# EAGLE schematic fpga-cplds-v2 (EAGLE 5.06)
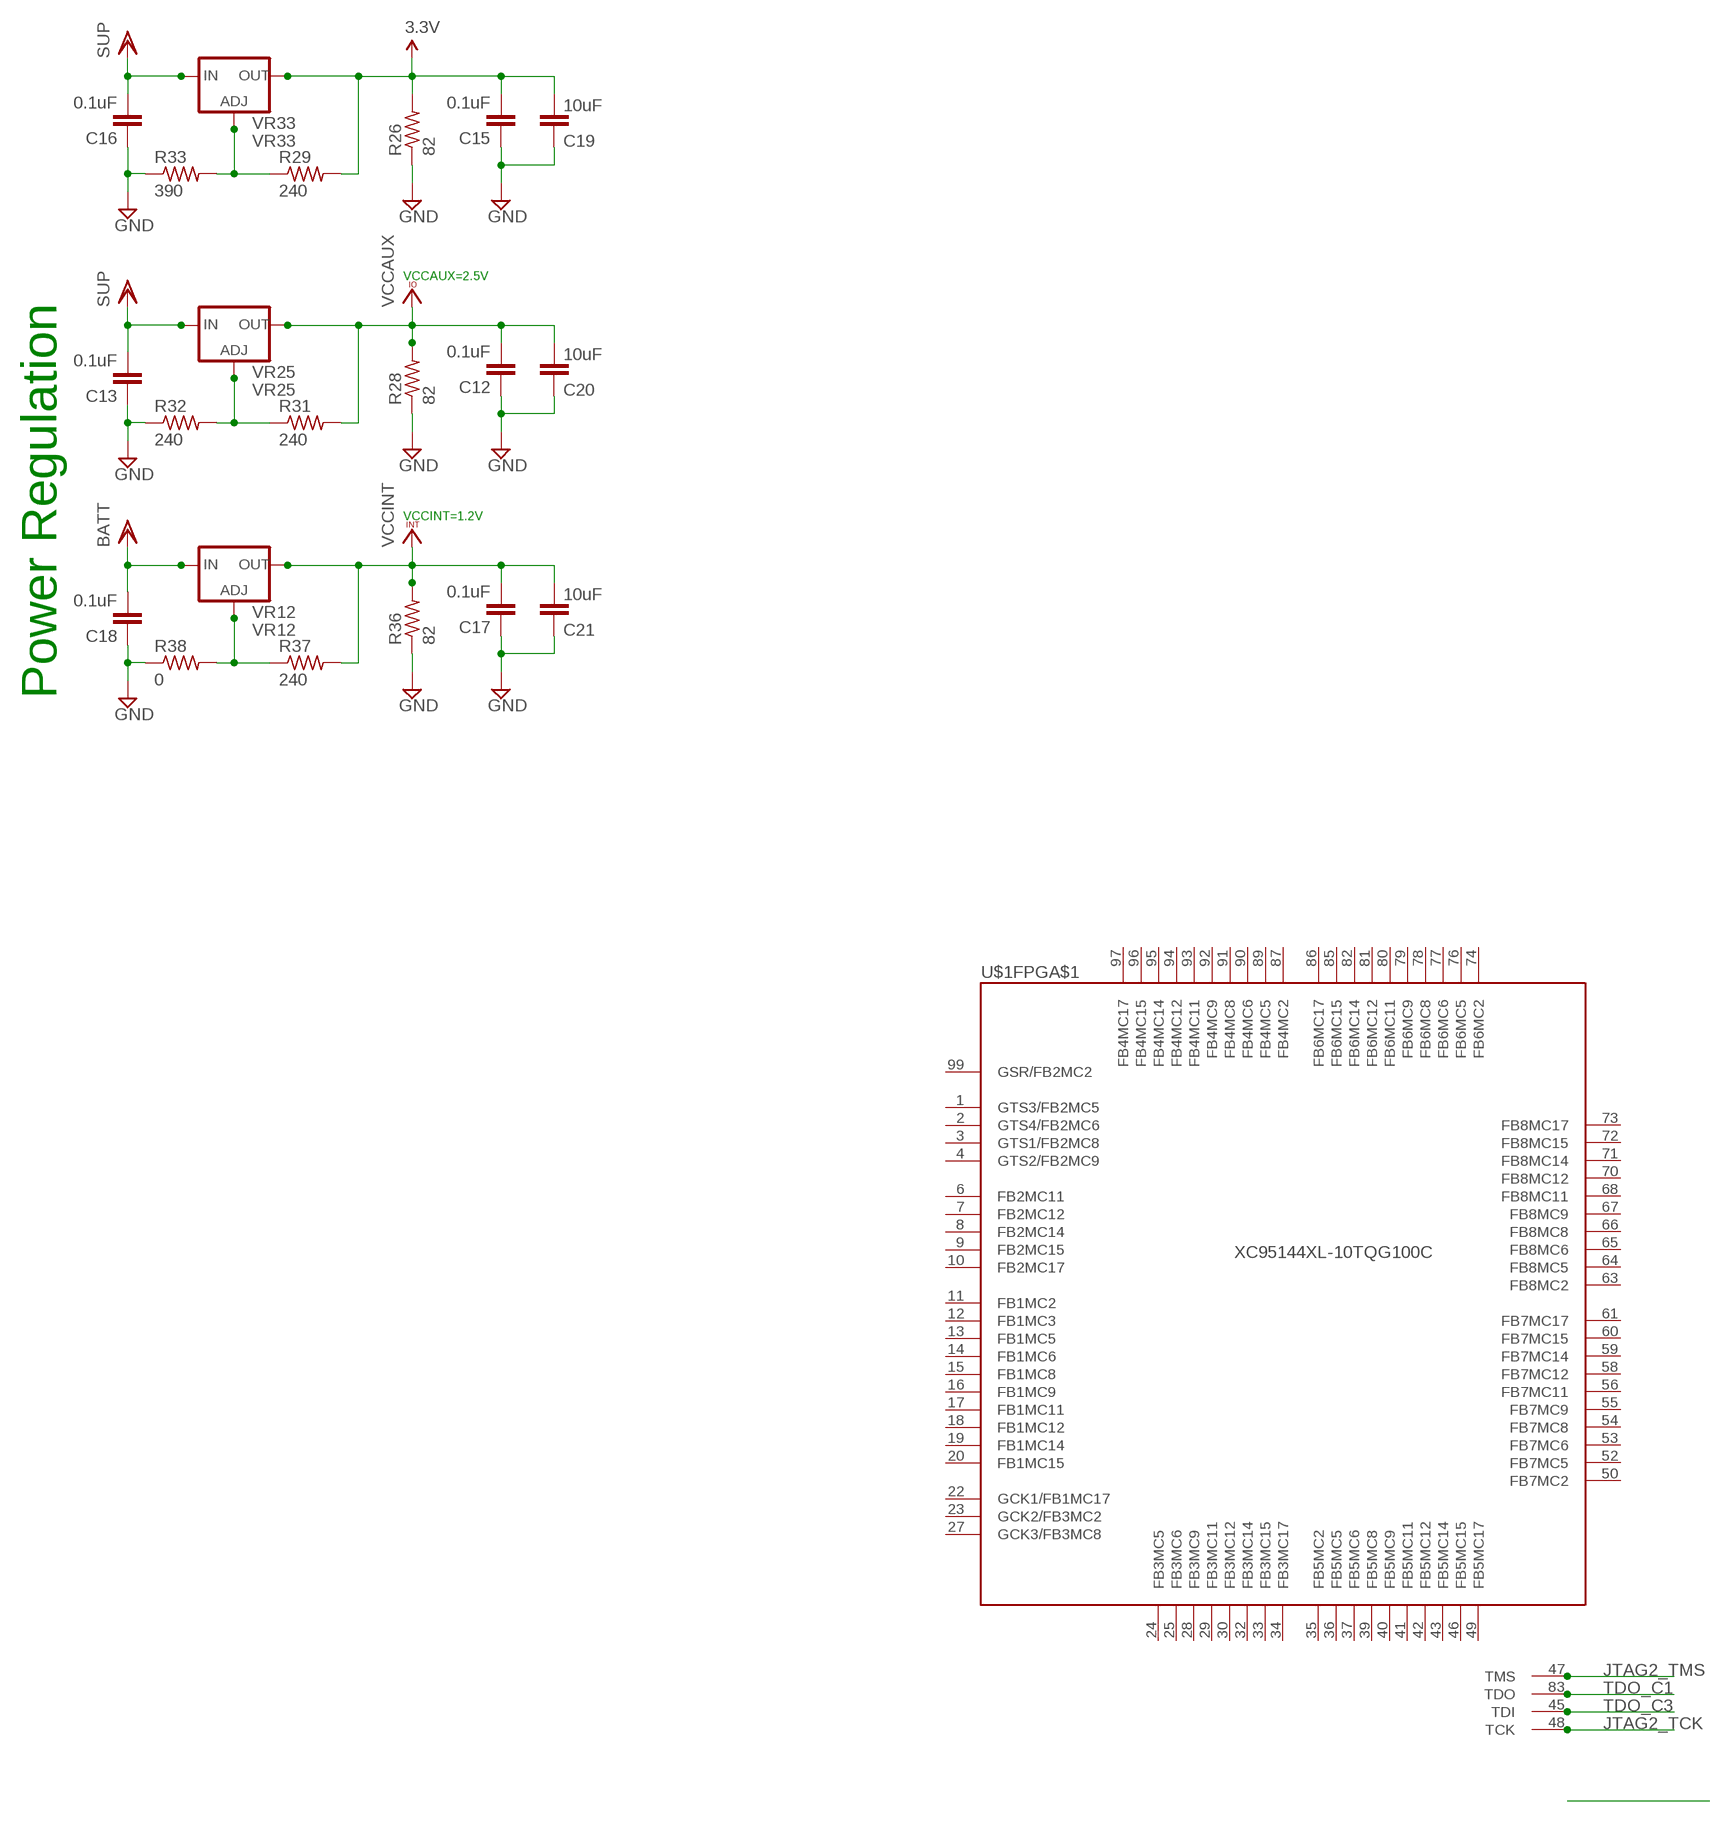
[diagram p0: schematic, sheet 1, part 1 of 2]
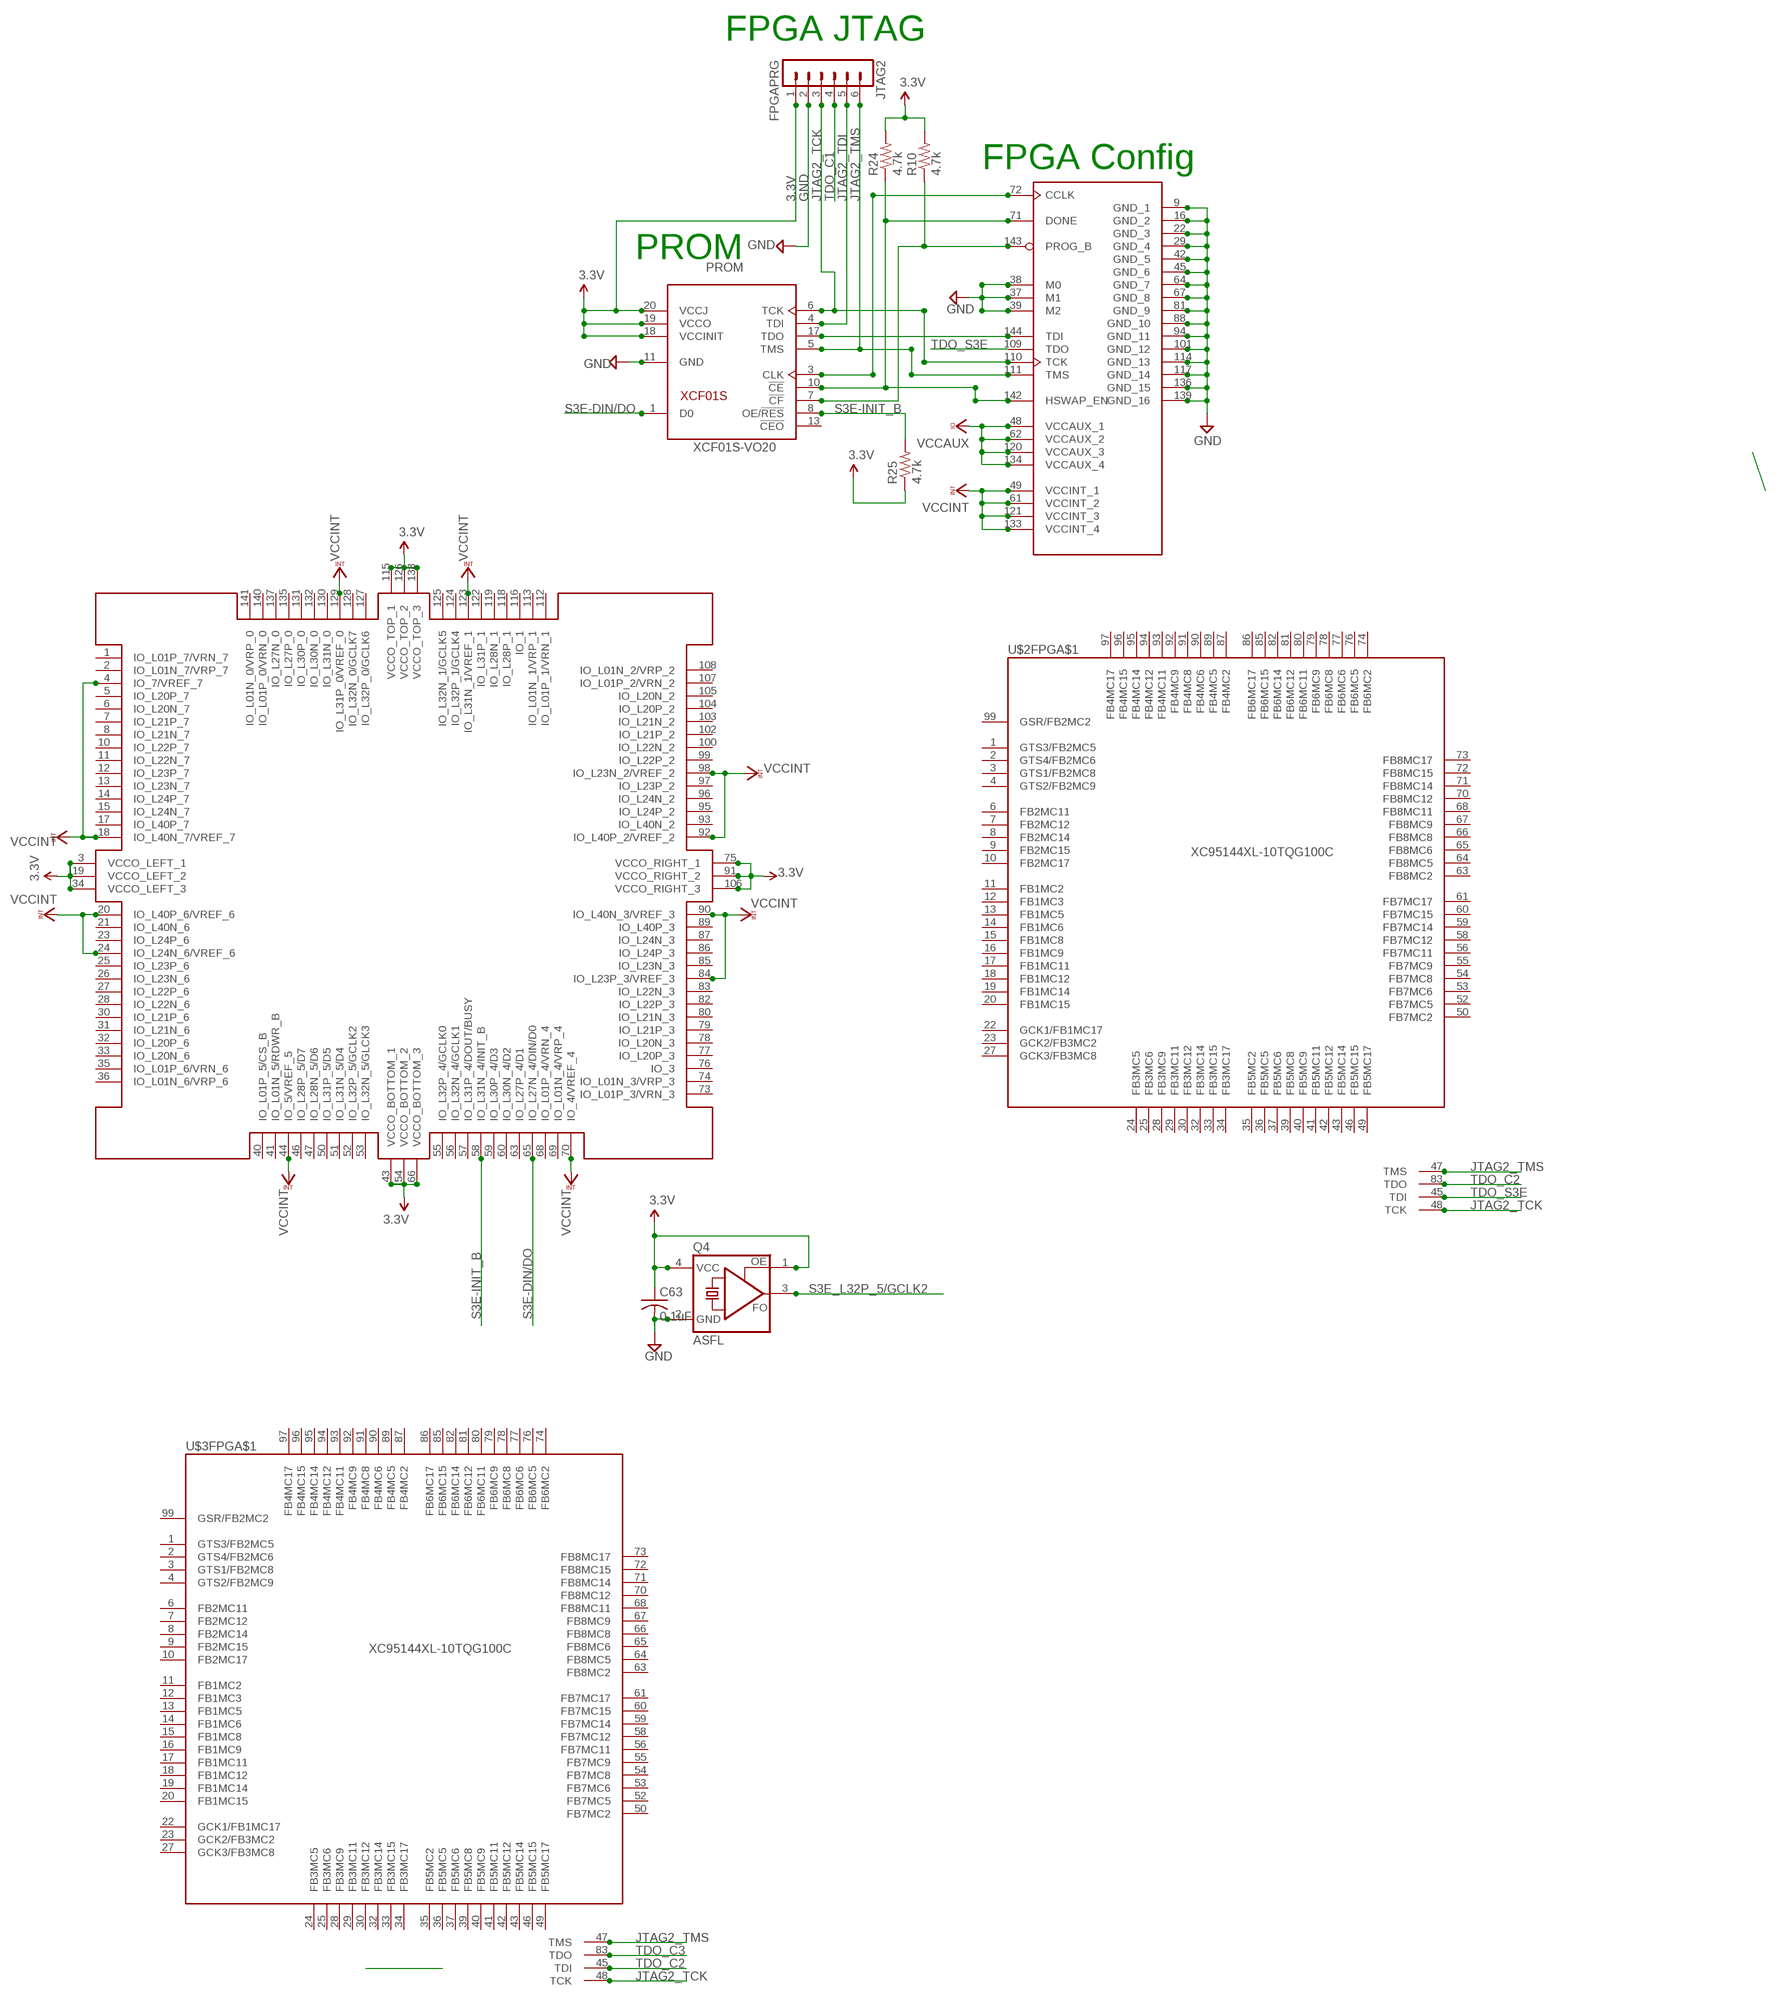
[diagram p1: schematic, sheet 1, part 2 of 2]

## Parts
C12  0.1uF  C-EUC0402  [C0402]
C13  0.1uF  C-EUC0402  [C0402]
C15  0.1uF  C-EUC0402  [C0402]
C16  0.1uF  C-EUC0402  [C0402]
C17  0.1uF  C-EUC0402  [C0402]
C18  0.1uF  C-EUC0402  [C0402]
C19  10uF  C-EUC1206  [C1206]
C20  10uF  C-EUC1206  [C1206]
C21  10uF  C-EUC1206  [C1206]
C63  0.1uF  C-USC0402  [C0402]
FPGA  XC3S200-TQ144  [TQ144]
JTAG2  FPGAPRG  MA06-1  [MA06-1]
PROM  XCF01S-VO20  [VO20]
Q4  ASFL  [ASF]
R10  4.7k  R-US_R0402  [R0402]
R24  4.7k  R-US_R0402  [R0402]
R25  4.7k  R-US_R0402  [R0402]
R26  82  R-US_R0402  [R0402]
R28  82  R-US_R0402  [R0402]
R29  240  R-US_R0402  [R0402]
R31  240  R-US_R0402  [R0402]
R32  240  R-US_R0402  [R0402]
R33  390  R-US_R0402  [R0402]
R36  82  R-US_R0402  [R0402]
R37  240  R-US_R0402  [R0402]
R38  0  R-US_R0402  [R0402]
U$1  XC95144XL-10TQG100C  [TQFP100]
U$2  XC95144XL-10TQG100C  [TQFP100]
U$3  XC95144XL-10TQG100C  [TQFP100]
VR12  VR12  V_REG_317SMD  [SOT223]
VR25  VR25  V_REG_317SMD  [SOT223]
VR33  VR33  V_REG_317SMD  [SOT223]

## Nets
3.3V: C15.2 C19.2 C63.1 FPGA.3(VCCO_LEFT_1) FPGA.19(VCCO_LEFT_2) FPGA.34(VCCO_LEFT_3) FPGA.43(VCCO_BOTTOM_1) FPGA.54(VCCO_BOTTOM_2) FPGA.66(VCCO_BOTTOM_3) FPGA.75(VCCO_RIGHT_1) FPGA.91(VCCO_RIGHT_2) FPGA.106(VCCO_RIGHT_3) FPGA.115(VCCO_TOP_1) FPGA.126(VCCO_TOP_2) FPGA.138(VCCO_TOP_3) JTAG2.1 PROM.18(VCCINIT) PROM.19(VCCO) PROM.20(VCCJ) Q4.1(OE) Q4.4(VCC) R10.2 R24.2 R25.1 R26.2 R29.2 VR33.2(OUT)
FPGA: FPGA.71(DONE) FPGA.142(HSWAP_EN) PROM.10(!CE) R24.1
GND: C12.1 C13.1 C15.1 C16.1 C17.1 C18.1 C19.1 C20.1 C21.1 C63.2 FPGA.9(GND_1) FPGA.16(GND_2) FPGA.22(GND_3) FPGA.29(GND_4) FPGA.37(M1) FPGA.38(M0) FPGA.39(M2) FPGA.42(GND_5) FPGA.45(GND_6) FPGA.64(GND_7) FPGA.67(GND_8) FPGA.81(GND_9) FPGA.88(GND_10) FPGA.94(GND_11) FPGA.101(GND_12) FPGA.114(GND_13) FPGA.117(GND_14) FPGA.136(GND_15) FPGA.139(GND_16) JTAG2.2 PROM.11(GND) Q4.2(GND) R26.1 R28.1 R32.1 R33.1 R36.1 R38.1
JTAG2_TCK: FPGA.110(TCK) JTAG2.3 PROM.6(TCK) U$1.48(TCK) U$2.48(TCK) U$3.48(TCK)
JTAG2_TDI: JTAG2.5 PROM.4(TDI)
JTAG2_TMS: FPGA.111(TMS) JTAG2.6 PROM.5(TMS) U$1.47(TMS) U$2.47(TMS) U$3.47(TMS)
N$12: FPGA.143(PROG_B) PROM.7(!CF) R10.1
N$22: R31.1 R32.2 VR25.1(ADJ)
N$25: R29.1 R33.2 VR33.1(ADJ)
N$28: R37.1 R38.2 VR12.1(ADJ)
N$40: FPGA.72(CCLK) PROM.3(CLK)
N$44: FPGA.144(TDI) PROM.17(TDO)
S3E-DIN/DO: FPGA.65(IO_L27N_4/DIN/D0) PROM.1(D0)
S3E-INIT_B: FPGA.58(IO_L31N_4/INIT_B) PROM.8(OE/!RES) R25.2
S3E_L32P_5/GCLK2: Q4.3(FO)
TDO_C1: JTAG2.4 U$1.83(TDO)
TDO_C2: U$2.83(TDO) U$3.45(TDI)
TDO_C3: U$1.45(TDI) U$3.83(TDO)
TDO_S3E: FPGA.109(TDO) U$2.45(TDI)
VCCINT: C17.2 C21.2 FPGA.4(IO_7/VREF_7) FPGA.18(IO_L40N_7/VREF_7) FPGA.20(IO_L40P_6/VREF_6) FPGA.24(IO_L24N_6/VREF_6) FPGA.44(IO_5/VREF_5) FPGA.49(VCCINT_1) FPGA.61(VCCINT_2) FPGA.70(IO_4/VREF_4) FPGA.84(IO_L23P_3/VREF_3) FPGA.90(IO_L40N_3/VREF_3) FPGA.92(IO_L40P_2/VREF_2) FPGA.98(IO_L23N_2/VREF_2) FPGA.121(VCCINT_3) FPGA.123(IO_L31N_1/VREF_1) FPGA.129(IO_L31P_0/VREF_0) FPGA.133(VCCINT_4) R36.2 R37.2 VR12.2(OUT)
VCCIO: C12.2 C20.2 FPGA.48(VCCAUX_1) FPGA.62(VCCAUX_2) FPGA.120(VCCAUX_3) FPGA.134(VCCAUX_4) R28.2 R31.2 VR25.2(OUT) ; supply symbol labelled VCCAUX
VDD: C13.2 C16.2 C18.2 VR12.3(IN) VR25.3(IN) VR33.3(IN) ; supply symbol labelled BATT, SUP
Unconnected: FPGA.1(IO_L01P_7/VRN_7) FPGA.2(IO_L01N_7/VRP_7) FPGA.5(IO_L20P_7) FPGA.6(IO_L20N_7) FPGA.7(IO_L21P_7) FPGA.8(IO_L21N_7) FPGA.10(IO_L22P_7) FPGA.11(IO_L22N_7) FPGA.12(IO_L23P_7) FPGA.13(IO_L23N_7) FPGA.14(IO_L24P_7) FPGA.15(IO_L24N_7) FPGA.17(IO_L40P_7) FPGA.21(IO_L40N_6) FPGA.23(IO_L24P_6) FPGA.25(IO_L23P_6) FPGA.26(IO_L23N_6) FPGA.27(IO_L22P_6) FPGA.28(IO_L22N_6) FPGA.30(IO_L21P_6) FPGA.31(IO_L21N_6) FPGA.32(IO_L20P_6) FPGA.33(IO_L20N_6) FPGA.35(IO_L01P_6/VRN_6) FPGA.36(IO_L01N_6/VRP_6) FPGA.40(IO_L01P_5/CS_B) FPGA.41(IO_L01N_5/RDWR_B) FPGA.46(IO_L28P_5/D7) FPGA.47(IO_L28N_5/D6) FPGA.50(IO_L31P_5/D5) FPGA.51(IO_L31N_5/D4) FPGA.52(IO_L32P_5/GCLK2) FPGA.53(IO_L32N_5/GLCK3) FPGA.55(IO_L32P_4/GCLK0) FPGA.56(IO_L32N_4/GCLK1) FPGA.57(IO_L31P_4/DOUT/BUSY) FPGA.59(IO_L30P_4/D3) FPGA.60(IO_L30N_4/D2) FPGA.63(IO_L27P_4/D1) FPGA.68(IO_L01P_4/VRN_4) FPGA.69(IO_L01N_4/VRP_4) FPGA.73(IO_L01P_3/VRN_3) FPGA.74(IO_L01N_3/VRP_3) FPGA.76(IO_3) FPGA.77(IO_L20P_3) FPGA.78(IO_L20N_3) FPGA.79(IO_L21P_3) FPGA.80(IO_L21N_3) FPGA.82(IO_L22P_3) FPGA.83(IO_L22N_3) FPGA.85(IO_L23N_3) FPGA.86(IO_L24P_3) FPGA.87(IO_L24N_3) FPGA.89(IO_L40P_3) FPGA.93(IO_L40N_2) FPGA.95(IO_L24P_2) FPGA.96(IO_L24N_2) FPGA.97(IO_L23P_2) FPGA.99(IO_L22P_2) FPGA.100(IO_L22N_2) FPGA.102(IO_L21P_2) FPGA.103(IO_L21N_2) FPGA.104(IO_L20P_2) FPGA.105(IO_L20N_2) FPGA.107(IO_L01P_2/VRN_2) FPGA.108(IO_L01N_2/VRP_2) FPGA.112(IO_L01P_1/VRN_1) FPGA.113(IO_L01N_1/VRP_1) FPGA.116(IO_1) FPGA.118(IO_L28P_1) FPGA.119(IO_L28N_1) FPGA.122(IO_L31P_1) FPGA.124(IO_L32P_1/GCLK4) FPGA.125(IO_L32N_1/GCLK5) FPGA.127(IO_L32P_0/GCLK6) FPGA.128(IO_L32N_0/GCLK7) FPGA.130(IO_L31N_0) FPGA.131(IO_L30P_0) FPGA.132(IO_L30N_0) FPGA.135(IO_L27P_0) FPGA.137(IO_L27N_0) FPGA.140(IO_L01P_0/VRN_0) FPGA.141(IO_L01N_0/VRP_0) PROM.13(!CEO) U$1.1(FPGA$1:GTS3/FB2MC5) U$1.2(FPGA$1:GTS4/FB2MC6) U$1.3(FPGA$1:GTS1/FB2MC8) U$1.4(FPGA$1:GTS2/FB2MC9) U$1.5(VCCINT1) U$1.6(FPGA$1:FB2MC11) U$1.7(FPGA$1:FB2MC12) U$1.8(FPGA$1:FB2MC14) U$1.9(FPGA$1:FB2MC15) U$1.10(FPGA$1:FB2MC17) U$1.11(FPGA$1:FB1MC2) U$1.12(FPGA$1:FB1MC3) U$1.13(FPGA$1:FB1MC5) U$1.14(FPGA$1:FB1MC6) U$1.15(FPGA$1:FB1MC8) U$1.16(FPGA$1:FB1MC9) U$1.17(FPGA$1:FB1MC11) U$1.18(FPGA$1:FB1MC12) U$1.19(FPGA$1:FB1MC14) U$1.20(FPGA$1:FB1MC15) U$1.21(GND1) U$1.22(FPGA$1:GCK1/FB1MC17) U$1.23(FPGA$1:GCK2/FB3MC2) U$1.24(FPGA$1:FB3MC5) U$1.25(FPGA$1:FB3MC6) U$1.26(VCCIO1) U$1.27(FPGA$1:GCK3/FB3MC8) U$1.28(FPGA$1:FB3MC9) U$1.29(FPGA$1:FB3MC11) U$1.30(FPGA$1:FB3MC12) U$1.31(GND2) U$1.32(FPGA$1:FB3MC14) U$1.33(FPGA$1:FB3MC15) U$1.34(FPGA$1:FB3MC17) U$1.35(FPGA$1:FB5MC2) U$1.36(FPGA$1:FB5MC5) U$1.37(FPGA$1:FB5MC6) U$1.38(VCCIO2) U$1.39(FPGA$1:FB5MC8) U$1.40(FPGA$1:FB5MC9) U$1.41(FPGA$1:FB5MC11) U$1.42(FPGA$1:FB5MC12) U$1.43(FPGA$1:FB5MC14) U$1.44(GND3) U$1.46(FPGA$1:FB5MC15) U$1.49(FPGA$1:FB5MC17) U$1.50(FPGA$1:FB7MC2) U$1.51(VCCIO3) U$1.52(FPGA$1:FB7MC5) U$1.53(FPGA$1:FB7MC6) U$1.54(FPGA$1:FB7MC8) U$1.55(FPGA$1:FB7MC9) U$1.56(FPGA$1:FB7MC11) U$1.57(VCCINT2) U$1.58(FPGA$1:FB7MC12) U$1.59(FPGA$1:FB7MC14) U$1.60(FPGA$1:FB7MC15) U$1.61(FPGA$1:FB7MC17) U$1.62(GND4) U$1.63(FPGA$1:FB8MC2) U$1.64(FPGA$1:FB8MC5) U$1.65(FPGA$1:FB8MC6) U$1.66(FPGA$1:FB8MC8) U$1.67(FPGA$1:FB8MC9) U$1.68(FPGA$1:FB8MC11) U$1.69(GND5) U$1.70(FPGA$1:FB8MC12) U$1.71(FPGA$1:FB8MC14) U$1.72(FPGA$1:FB8MC15) U$1.73(FPGA$1:FB8MC17) U$1.74(FPGA$1:FB6MC2) U$1.75(GND6) U$1.76(FPGA$1:FB6MC5) U$1.77(FPGA$1:FB6MC6) U$1.78(FPGA$1:FB6MC8) U$1.79(FPGA$1:FB6MC9) U$1.80(FPGA$1:FB6MC11) U$1.81(FPGA$1:FB6MC12) U$1.82(FPGA$1:FB6MC14) U$1.84(GND7) U$1.85(FPGA$1:FB6MC15) U$1.86(FPGA$1:FB6MC17) U$1.87(FPGA$1:FB4MC2) U$1.88(VCCIO4) U$1.89(FPGA$1:FB4MC5) U$1.90(FPGA$1:FB4MC6) U$1.91(FPGA$1:FB4MC8) U$1.92(FPGA$1:FB4MC9) U$1.93(FPGA$1:FB4MC11) U$1.94(FPGA$1:FB4MC12) U$1.95(FPGA$1:FB4MC14) U$1.96(FPGA$1:FB4MC15) U$1.97(FPGA$1:FB4MC17) U$1.98(VCCINT3) U$1.99(FPGA$1:GSR/FB2MC2) U$1.100(GND8) U$2.1(FPGA$1:GTS3/FB2MC5) U$2.2(FPGA$1:GTS4/FB2MC6) U$2.3(FPGA$1:GTS1/FB2MC8) U$2.4(FPGA$1:GTS2/FB2MC9) U$2.5(VCCINT1) U$2.6(FPGA$1:FB2MC11) U$2.7(FPGA$1:FB2MC12) U$2.8(FPGA$1:FB2MC14) U$2.9(FPGA$1:FB2MC15) U$2.10(FPGA$1:FB2MC17) U$2.11(FPGA$1:FB1MC2) U$2.12(FPGA$1:FB1MC3) U$2.13(FPGA$1:FB1MC5) U$2.14(FPGA$1:FB1MC6) U$2.15(FPGA$1:FB1MC8) U$2.16(FPGA$1:FB1MC9) U$2.17(FPGA$1:FB1MC11) U$2.18(FPGA$1:FB1MC12) U$2.19(FPGA$1:FB1MC14) U$2.20(FPGA$1:FB1MC15) U$2.21(GND1) U$2.22(FPGA$1:GCK1/FB1MC17) U$2.23(FPGA$1:GCK2/FB3MC2) U$2.24(FPGA$1:FB3MC5) U$2.25(FPGA$1:FB3MC6) U$2.26(VCCIO1) U$2.27(FPGA$1:GCK3/FB3MC8) U$2.28(FPGA$1:FB3MC9) U$2.29(FPGA$1:FB3MC11) U$2.30(FPGA$1:FB3MC12) U$2.31(GND2) U$2.32(FPGA$1:FB3MC14) U$2.33(FPGA$1:FB3MC15) U$2.34(FPGA$1:FB3MC17) U$2.35(FPGA$1:FB5MC2) U$2.36(FPGA$1:FB5MC5) U$2.37(FPGA$1:FB5MC6) U$2.38(VCCIO2) U$2.39(FPGA$1:FB5MC8) U$2.40(FPGA$1:FB5MC9) U$2.41(FPGA$1:FB5MC11) U$2.42(FPGA$1:FB5MC12) U$2.43(FPGA$1:FB5MC14) U$2.44(GND3) U$2.46(FPGA$1:FB5MC15) U$2.49(FPGA$1:FB5MC17) U$2.50(FPGA$1:FB7MC2) U$2.51(VCCIO3) U$2.52(FPGA$1:FB7MC5) U$2.53(FPGA$1:FB7MC6) U$2.54(FPGA$1:FB7MC8) U$2.55(FPGA$1:FB7MC9) U$2.56(FPGA$1:FB7MC11) U$2.57(VCCINT2) U$2.58(FPGA$1:FB7MC12) U$2.59(FPGA$1:FB7MC14) U$2.60(FPGA$1:FB7MC15) U$2.61(FPGA$1:FB7MC17) U$2.62(GND4) U$2.63(FPGA$1:FB8MC2) U$2.64(FPGA$1:FB8MC5) U$2.65(FPGA$1:FB8MC6) U$2.66(FPGA$1:FB8MC8) U$2.67(FPGA$1:FB8MC9) U$2.68(FPGA$1:FB8MC11) U$2.69(GND5) U$2.70(FPGA$1:FB8MC12) U$2.71(FPGA$1:FB8MC14) U$2.72(FPGA$1:FB8MC15) U$2.73(FPGA$1:FB8MC17) U$2.74(FPGA$1:FB6MC2) U$2.75(GND6) U$2.76(FPGA$1:FB6MC5) U$2.77(FPGA$1:FB6MC6) U$2.78(FPGA$1:FB6MC8) U$2.79(FPGA$1:FB6MC9) U$2.80(FPGA$1:FB6MC11) U$2.81(FPGA$1:FB6MC12) U$2.82(FPGA$1:FB6MC14) U$2.84(GND7) U$2.85(FPGA$1:FB6MC15) U$2.86(FPGA$1:FB6MC17) U$2.87(FPGA$1:FB4MC2) U$2.88(VCCIO4) U$2.89(FPGA$1:FB4MC5) U$2.90(FPGA$1:FB4MC6) U$2.91(FPGA$1:FB4MC8) U$2.92(FPGA$1:FB4MC9) U$2.93(FPGA$1:FB4MC11) U$2.94(FPGA$1:FB4MC12) U$2.95(FPGA$1:FB4MC14) U$2.96(FPGA$1:FB4MC15) U$2.97(FPGA$1:FB4MC17) U$2.98(VCCINT3) U$2.99(FPGA$1:GSR/FB2MC2) U$2.100(GND8) U$3.1(FPGA$1:GTS3/FB2MC5) U$3.2(FPGA$1:GTS4/FB2MC6) U$3.3(FPGA$1:GTS1/FB2MC8) U$3.4(FPGA$1:GTS2/FB2MC9) U$3.5(VCCINT1) U$3.6(FPGA$1:FB2MC11) U$3.7(FPGA$1:FB2MC12) U$3.8(FPGA$1:FB2MC14) U$3.9(FPGA$1:FB2MC15) U$3.10(FPGA$1:FB2MC17) U$3.11(FPGA$1:FB1MC2) U$3.12(FPGA$1:FB1MC3) U$3.13(FPGA$1:FB1MC5) U$3.14(FPGA$1:FB1MC6) U$3.15(FPGA$1:FB1MC8) U$3.16(FPGA$1:FB1MC9) U$3.17(FPGA$1:FB1MC11) U$3.18(FPGA$1:FB1MC12) U$3.19(FPGA$1:FB1MC14) U$3.20(FPGA$1:FB1MC15) U$3.21(GND1) U$3.22(FPGA$1:GCK1/FB1MC17) U$3.23(FPGA$1:GCK2/FB3MC2) U$3.24(FPGA$1:FB3MC5) U$3.25(FPGA$1:FB3MC6) U$3.26(VCCIO1) U$3.27(FPGA$1:GCK3/FB3MC8) U$3.28(FPGA$1:FB3MC9) U$3.29(FPGA$1:FB3MC11) U$3.30(FPGA$1:FB3MC12) U$3.31(GND2) U$3.32(FPGA$1:FB3MC14) U$3.33(FPGA$1:FB3MC15) U$3.34(FPGA$1:FB3MC17) U$3.35(FPGA$1:FB5MC2) U$3.36(FPGA$1:FB5MC5) U$3.37(FPGA$1:FB5MC6) U$3.38(VCCIO2) U$3.39(FPGA$1:FB5MC8) U$3.40(FPGA$1:FB5MC9) U$3.41(FPGA$1:FB5MC11) U$3.42(FPGA$1:FB5MC12) U$3.43(FPGA$1:FB5MC14) U$3.44(GND3) U$3.46(FPGA$1:FB5MC15) U$3.49(FPGA$1:FB5MC17) U$3.50(FPGA$1:FB7MC2) U$3.51(VCCIO3) U$3.52(FPGA$1:FB7MC5) U$3.53(FPGA$1:FB7MC6) U$3.54(FPGA$1:FB7MC8) U$3.55(FPGA$1:FB7MC9) U$3.56(FPGA$1:FB7MC11) U$3.57(VCCINT2) U$3.58(FPGA$1:FB7MC12) U$3.59(FPGA$1:FB7MC14) U$3.60(FPGA$1:FB7MC15) U$3.61(FPGA$1:FB7MC17) U$3.62(GND4) U$3.63(FPGA$1:FB8MC2) U$3.64(FPGA$1:FB8MC5) U$3.65(FPGA$1:FB8MC6) U$3.66(FPGA$1:FB8MC8) U$3.67(FPGA$1:FB8MC9) U$3.68(FPGA$1:FB8MC11) U$3.69(GND5) U$3.70(FPGA$1:FB8MC12) U$3.71(FPGA$1:FB8MC14) U$3.72(FPGA$1:FB8MC15) U$3.73(FPGA$1:FB8MC17) U$3.74(FPGA$1:FB6MC2) U$3.75(GND6) U$3.76(FPGA$1:FB6MC5) U$3.77(FPGA$1:FB6MC6) U$3.78(FPGA$1:FB6MC8) U$3.79(FPGA$1:FB6MC9) U$3.80(FPGA$1:FB6MC11) U$3.81(FPGA$1:FB6MC12) U$3.82(FPGA$1:FB6MC14) U$3.84(GND7) U$3.85(FPGA$1:FB6MC15) U$3.86(FPGA$1:FB6MC17) U$3.87(FPGA$1:FB4MC2) U$3.88(VCCIO4) U$3.89(FPGA$1:FB4MC5) U$3.90(FPGA$1:FB4MC6) U$3.91(FPGA$1:FB4MC8) U$3.92(FPGA$1:FB4MC9) U$3.93(FPGA$1:FB4MC11) U$3.94(FPGA$1:FB4MC12) U$3.95(FPGA$1:FB4MC14) U$3.96(FPGA$1:FB4MC15) U$3.97(FPGA$1:FB4MC17) U$3.98(VCCINT3) U$3.99(FPGA$1:GSR/FB2MC2) U$3.100(GND8)

## Notes on the sheet
- FPGA JTAG
- VCCAUX=2.5V
- FPGA Config
- PROM
- VCCINT=1.2V
- Power Regulation

## Library data of the parts
C12 C13 C15-C21 = rcl:C-EU: CAPACITOR, European symbol
C63 = rcl:C-US: CAPACITOR, American symbol
FPGA = xc3s200-tq144:XC3S200-TQ144
JTAG2 = con-lstb:MA06-1: PIN HEADER
PROM = xilinx_virtexii-xc2v80&flashprom:XCF01S-VO20: Flash Prom with 1MBit Schinko / Baier
Q4 = crystal:ASF*: CRYSTAL CLOCK OSCILLATORS 5.0 Vdc or 3.3 Vdc - LOW PROFILE ULTRA MINIATURE CERAMIC SURFACE MOUNT Source: http://www.abracon.com/Oscillators/asf1-L-L1.pdf
R10 R24-R26 R28 R29 R31-R33 R36-R38 = rcl:R-US_: RESISTOR, American symbol
U$1-U$3 = okie:XC95144XL-10TQG100C
VR12 VR25 VR33 = SparkFun:V_REG_317: Voltage Regulator Standard LM317 adjustable voltage regulator. AOI (Adjust Output Input). Google 'LM317 Calculator' for easy to use app to get the two resistor values needed. 240/720 for 5V output. 240/390 for 3.3V output. Spark Fun Electronics SKU : COM-00527